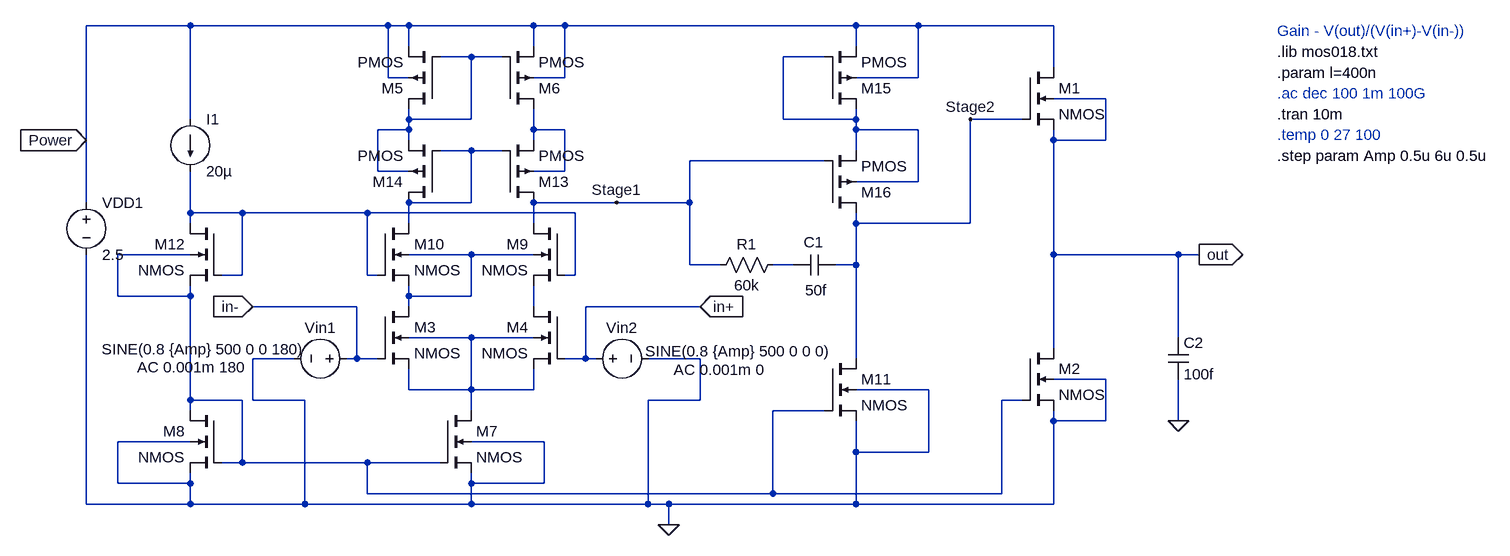
[diagram p0: schematic Output Swing using .tran.asc]
Output Swing using .tran.asc, the LTspice schematic file:
Version 4
SHEET 1 1516 680
WIRE -496 -320 -656 -320
WIRE -192 -320 -496 -320
WIRE -160 -320 -192 -320
WIRE 32 -320 -160 -320
WIRE 80 -320 32 -320
WIRE 528 -320 80 -320
WIRE 624 -320 528 -320
WIRE 832 -320 624 -320
WIRE -160 -288 -160 -320
WIRE 32 -288 32 -320
WIRE 528 -288 528 -320
WIRE -64 -272 -112 -272
WIRE -16 -272 -64 -272
WIRE 480 -272 416 -272
WIRE 832 -256 832 -320
WIRE -192 -240 -192 -320
WIRE -160 -240 -192 -240
WIRE 80 -240 80 -320
WIRE 80 -240 32 -240
WIRE 624 -240 624 -320
WIRE 624 -240 528 -240
WIRE 912 -208 832 -208
WIRE -496 -176 -496 -320
WIRE -160 -176 -160 -192
WIRE -64 -176 -64 -272
WIRE -64 -176 -160 -176
WIRE 416 -176 416 -272
WIRE 528 -176 528 -192
WIRE 528 -176 416 -176
WIRE 784 -176 704 -176
WIRE -160 -160 -160 -176
WIRE -160 -160 -208 -160
WIRE 32 -160 32 -192
WIRE 80 -160 32 -160
WIRE 528 -160 528 -176
WIRE 624 -160 528 -160
WIRE -656 -144 -656 -320
WIRE -160 -144 -160 -160
WIRE 32 -144 32 -160
WIRE 832 -144 832 -160
WIRE 912 -144 912 -208
WIRE 912 -144 832 -144
WIRE -64 -128 -112 -128
WIRE -16 -128 -64 -128
WIRE 528 -128 528 -160
WIRE 480 -112 272 -112
WIRE -208 -96 -208 -160
WIRE -160 -96 -208 -96
WIRE 80 -96 80 -160
WIRE 80 -96 32 -96
WIRE 624 -80 624 -160
WIRE 624 -80 528 -80
WIRE -656 -48 -656 -144
WIRE -64 -48 -64 -128
WIRE -64 -48 -160 -48
WIRE 160 -48 32 -48
WIRE 272 -48 272 -112
WIRE 272 -48 160 -48
WIRE -496 -32 -496 -96
WIRE -416 -32 -496 -32
WIRE -224 -32 -416 -32
WIRE 96 -32 -224 -32
WIRE -496 -16 -496 -32
WIRE -160 -16 -160 -48
WIRE 32 -16 32 -48
WIRE 528 -16 528 -32
WIRE 704 -16 704 -176
WIRE 704 -16 528 -16
WIRE -496 32 -608 32
WIRE -64 32 -160 32
WIRE 32 32 -64 32
WIRE 832 32 832 -144
WIRE 1024 32 832 32
WIRE 1056 32 1024 32
WIRE 272 48 272 -48
WIRE 320 48 272 48
WIRE 432 48 400 48
WIRE 528 48 528 -16
WIRE 528 48 496 48
WIRE -416 64 -416 -32
WIRE -416 64 -448 64
WIRE -224 64 -224 -32
WIRE -208 64 -224 64
WIRE 96 64 96 -32
WIRE 96 64 80 64
WIRE -608 96 -608 32
WIRE -496 96 -496 80
WIRE -496 96 -608 96
WIRE -160 96 -160 80
WIRE -64 96 -64 32
WIRE -64 96 -160 96
WIRE -240 112 -400 112
WIRE -160 112 -160 96
WIRE 32 112 32 80
WIRE 288 112 112 112
WIRE -64 160 -160 160
WIRE 32 160 -64 160
WIRE 1024 160 1024 32
WIRE 832 176 832 32
WIRE -336 192 -400 192
WIRE -240 192 -240 112
WIRE -240 192 -256 192
WIRE -208 192 -240 192
WIRE 112 192 112 112
WIRE 112 192 80 192
WIRE 128 192 112 192
WIRE 288 192 208 192
WIRE 528 192 528 48
WIRE 912 224 832 224
WIRE -160 240 -160 208
WIRE -64 240 -64 160
WIRE -64 240 -160 240
WIRE 32 240 32 208
WIRE 32 240 -64 240
WIRE 640 240 528 240
WIRE -496 256 -496 96
WIRE -416 256 -496 256
WIRE -400 256 -400 192
WIRE -320 256 -400 256
WIRE 288 256 288 192
WIRE 288 256 208 256
WIRE 784 256 752 256
WIRE -496 272 -496 256
WIRE -64 272 -64 240
WIRE 480 272 400 272
WIRE 832 288 832 272
WIRE 912 288 912 224
WIRE 912 288 832 288
WIRE 1024 288 1024 224
WIRE -496 320 -608 320
WIRE 48 320 -64 320
WIRE 528 336 528 288
WIRE 640 336 640 240
WIRE 640 336 528 336
WIRE -416 352 -416 256
WIRE -416 352 -448 352
WIRE -224 352 -416 352
WIRE -112 352 -224 352
WIRE -608 384 -608 320
WIRE -496 384 -496 368
WIRE -496 384 -608 384
WIRE -64 384 -64 368
WIRE 48 384 48 320
WIRE 48 384 -64 384
WIRE -224 400 -224 352
WIRE 400 400 400 272
WIRE 400 400 -224 400
WIRE 752 400 752 256
WIRE 752 400 400 400
WIRE -656 416 -656 32
WIRE -496 416 -496 384
WIRE -496 416 -656 416
WIRE -320 416 -320 256
WIRE -320 416 -496 416
WIRE -64 416 -64 384
WIRE -64 416 -320 416
WIRE 208 416 208 256
WIRE 208 416 -64 416
WIRE 240 416 208 416
WIRE 528 416 528 336
WIRE 528 416 240 416
WIRE 832 416 832 288
WIRE 832 416 528 416
WIRE 240 448 240 416
FLAG 1056 32 out
IOPIN 1056 32 Out
FLAG 240 448 0
FLAG 288 112 in+
IOPIN 288 112 In
FLAG -400 112 in-
IOPIN -400 112 In
FLAG 160 -48 Stage1
FLAG 704 -176 Stage2
FLAG -656 -144 Power
IOPIN -656 -144 In
FLAG 1024 288 0
SYMBOL nmos4 784 -256 R0
SYMATTR InstName M1
SYMATTR Value2 l={l} w=0.5u m=20
SYMBOL nmos4 784 176 R0
SYMATTR InstName M2
SYMATTR Value2 l={l} w=10u m=3
SYMBOL nmos4 -208 112 R0
SYMATTR InstName M3
SYMATTR Value2 l={l} w=0.5u m=1
SYMBOL nmos4 80 112 M0
SYMATTR InstName M4
SYMATTR Value2 l={l} w=0.5u m=1
SYMBOL pmos4 -112 -192 R180
SYMATTR InstName M5
SYMATTR Value2 l={l} w=1u m=2
SYMBOL pmos4 -16 -192 M180
SYMATTR InstName M6
SYMATTR Value2 l={l} w=1u m=2
SYMBOL nmos4 -112 272 R0
SYMATTR InstName M7
SYMATTR Value2 l={l} w=2u
SYMBOL current -496 -176 R0
WINDOW 123 0 0 Left 0
WINDOW 39 0 0 Left 0
SYMATTR InstName I1
SYMATTR Value 20µ
SYMBOL nmos4 -448 272 M0
SYMATTR InstName M8
SYMATTR Value2 l={l} w=10u
SYMBOL voltage -656 -64 R0
WINDOW 123 0 0 Left 0
WINDOW 39 0 0 Left 0
SYMATTR InstName VDD1
SYMATTR Value 2.5
SYMBOL voltage -240 192 R90
WINDOW 0 -32 56 VBottom 2
WINDOW 3 -30 236 VTop 2
WINDOW 123 -2 254 VTop 2
WINDOW 39 -2 236 VTop 2
SYMATTR InstName Vin1
SYMATTR Value SINE(0.8 {Amp} 500 0 0 180)
SYMATTR Value2 AC 0.001m 180
SYMBOL voltage 112 192 R270
WINDOW 0 32 56 VTop 2
WINDOW 3 27 235 VBottom 2
WINDOW 123 -2 206 VBottom 2
WINDOW 39 -1 235 VBottom 2
SYMATTR InstName Vin2
SYMATTR Value SINE(0.8 {Amp} 500 0 0 0)
SYMATTR Value2 AC 0.001m 0
SYMBOL nmos4 80 -16 M0
SYMATTR InstName M9
SYMATTR Value2 l={l} w=0.5u m=1
SYMBOL nmos4 -208 -16 R0
SYMATTR InstName M10
SYMATTR Value2 l={l} w=0.5u m=1
SYMBOL nmos4 480 192 R0
SYMATTR InstName M11
SYMATTR Value2 l={l} w=1u m=5
SYMBOL cap 496 32 R90
WINDOW 0 -3 33 VBottom 2
WINDOW 3 39 29 VTop 2
SYMATTR InstName C1
SYMATTR Value 50f
SYMBOL nmos4 -448 -16 M0
SYMATTR InstName M12
SYMATTR Value2 l={l} w=1u
SYMBOL pmos4 -16 -48 M180
SYMATTR InstName M13
SYMATTR Value2 l={l} w=1u m=1
SYMBOL pmos4 -112 -48 R180
SYMATTR InstName M14
SYMATTR Value2 l={l} w=1u m=1
SYMBOL pmos4 480 -192 M180
SYMATTR InstName M15
SYMATTR Value2 l={l} w=0.5u m=25
SYMBOL pmos4 480 -32 M180
SYMATTR InstName M16
SYMATTR Value2 l={l} w=0.5u m=10
SYMBOL res 416 32 R90
WINDOW 0 0 56 VBottom 2
WINDOW 3 32 56 VTop 2
SYMATTR InstName R1
SYMATTR Value 60k
SYMBOL cap 1008 160 R0
SYMATTR InstName C2
SYMATTR Value 100f
TEXT 1176 -184 Left 2 !.tran 10m
TEXT 1176 -152 Left 2 ;.temp 0 27 100
TEXT 1176 -216 Left 2 ;.ac dec 100 1m 100G
TEXT 1176 -248 Left 2 !.param l=400n
TEXT 1176 -280 Left 2 !.lib mos018.txt
TEXT 1176 -312 Left 2 ;Gain - V(out)/(V(in+)-V(in-))
TEXT 1176 -120 Left 2 !.step param Amp 0.5u 6u 0.5u

The netlist it stands for:
* Output Swing using .tran.asc
M1 Power Stage2 out out NMOS l={l} w=0.5u m=20
M2 out N006 0 0 NMOS l={l} w=10u m=3
M3 N007 in- N010 N010 NMOS l={l} w=0.5u m=1
M4 N009 in+ N010 N010 NMOS l={l} w=0.5u m=1
M5 N001 N001 Power Power PMOS l={l} w=1u m=2
M6 N003 N001 Power Power PMOS l={l} w=1u m=2
M7 N010 N006 0 0 NMOS l={l} w=2u
I1 Power N005 20µ
M8 N006 N006 0 0 NMOS l={l} w=10u
VDD1 Power 0 2.5
Vin1 in- 0 SINE(0.8 {Amp} 500 0 0 180) AC 0.001m 180
Vin2 in+ 0 SINE(0.8 {Amp} 500 0 0 0) AC 0.001m 0
M9 Stage1 N005 N009 N007 NMOS l={l} w=0.5u m=1
M10 N004 N005 N007 N007 NMOS l={l} w=0.5u m=1
M11 Stage2 N006 0 0 NMOS l={l} w=1u m=5
C1 Stage2 N008 50f
M12 N005 N005 N006 N006 NMOS l={l} w=1u
M13 Stage1 N004 N003 N003 PMOS l={l} w=1u m=1
M14 N004 N004 N001 N001 PMOS l={l} w=1u m=1
M15 N002 N002 Power Power PMOS l={l} w=0.5u m=25
M16 Stage2 Stage1 N002 N002 PMOS l={l} w=0.5u m=10
R1 N008 Stage1 60k
C2 out 0 100f
.model NMOS NMOS
.model PMOS PMOS
.lib standard.mos
.tran 10m
* .temp 0 27 100
* .ac dec 100 1m 100G
.param l=400n
.lib mos018.txt
* Gain - V(out)/(V(in+)-V(in-))
.step param Amp 0.5u 6u 0.5u
.backanno
.end